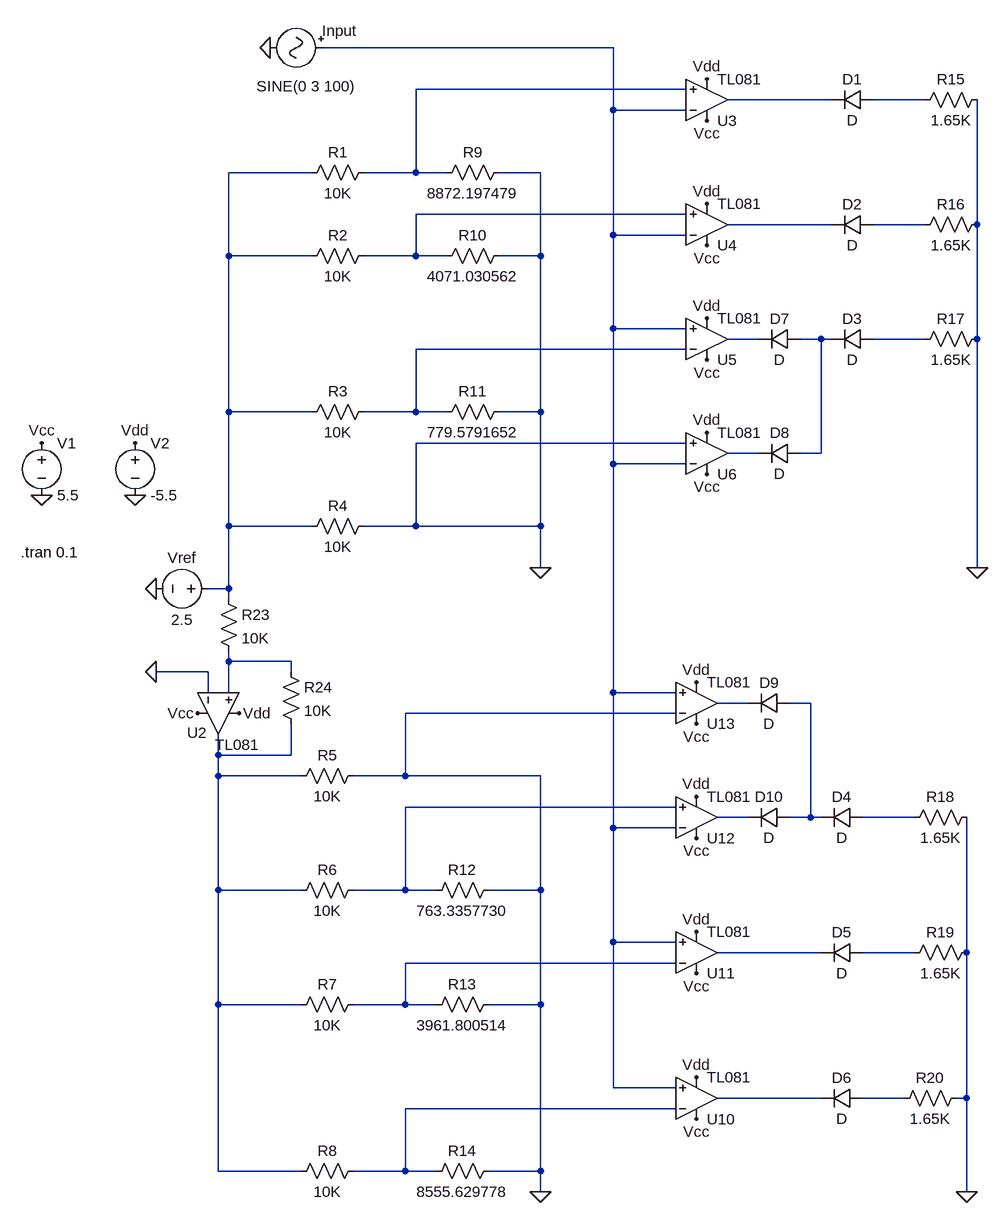
[diagram p0: schematic Komparator system.asc]
Komparator system.asc, the LTspice schematic file:
Version 4
SHEET 1 936 2496
WIRE 288 -560 -160 -560
WIRE 400 -496 -16 -496
WIRE 624 -480 464 -480
WIRE 768 -480 688 -480
WIRE 288 -464 288 -560
WIRE 400 -464 288 -464
WIRE -176 -368 -304 -368
WIRE -16 -368 -16 -496
WIRE -16 -368 -96 -368
WIRE 32 -368 -16 -368
WIRE 176 -368 112 -368
WIRE 400 -304 -16 -304
WIRE 624 -288 464 -288
WIRE 768 -288 688 -288
WIRE 848 -288 848 -480
WIRE 288 -272 288 -464
WIRE 400 -272 288 -272
WIRE -304 -240 -304 -368
WIRE -176 -240 -304 -240
WIRE -16 -240 -16 -304
WIRE -16 -240 -96 -240
WIRE 32 -240 -16 -240
WIRE 176 -240 176 -368
WIRE 176 -240 112 -240
WIRE 288 -128 288 -272
WIRE 400 -128 288 -128
WIRE 512 -112 464 -112
WIRE 608 -112 576 -112
WIRE 624 -112 608 -112
WIRE 768 -112 688 -112
WIRE 848 -112 848 -288
WIRE 400 -96 -16 -96
WIRE -304 0 -304 -240
WIRE -176 0 -304 0
WIRE -16 0 -16 -96
WIRE -16 0 -96 0
WIRE 32 0 -16 0
WIRE 176 0 176 -240
WIRE 176 0 112 0
WIRE 400 48 -16 48
WIRE 512 64 464 64
WIRE 608 64 608 -112
WIRE 608 64 576 64
WIRE 288 80 288 -128
WIRE 400 80 288 80
WIRE -304 176 -304 0
WIRE -176 176 -304 176
WIRE -16 176 -16 48
WIRE -16 176 -96 176
WIRE 176 176 176 0
WIRE 176 176 -16 176
WIRE 176 240 176 176
WIRE 848 240 848 -112
WIRE -304 272 -304 176
WIRE -304 272 -336 272
WIRE -304 288 -304 272
WIRE -304 384 -304 368
WIRE -208 384 -304 384
WIRE -336 400 -416 400
WIRE -208 400 -208 384
WIRE -336 432 -336 400
WIRE -304 432 -304 384
WIRE 288 432 288 80
WIRE 384 432 288 432
WIRE 496 448 448 448
WIRE 592 448 560 448
WIRE 384 464 -32 464
WIRE -320 528 -320 496
WIRE -208 528 -208 480
WIRE -208 528 -320 528
WIRE -320 560 -320 528
WIRE -192 560 -320 560
WIRE -32 560 -32 464
WIRE -32 560 -112 560
WIRE 176 560 -32 560
WIRE 384 608 -32 608
WIRE 496 624 448 624
WIRE 592 624 592 448
WIRE 592 624 560 624
WIRE 608 624 592 624
WIRE 752 624 672 624
WIRE 288 640 288 432
WIRE 384 640 288 640
WIRE -320 736 -320 560
WIRE -192 736 -320 736
WIRE -32 736 -32 608
WIRE -32 736 -112 736
WIRE 16 736 -32 736
WIRE 176 736 176 560
WIRE 176 736 96 736
WIRE 288 816 288 640
WIRE 384 816 288 816
WIRE 608 832 448 832
WIRE 752 832 672 832
WIRE 832 832 832 624
WIRE 384 848 -32 848
WIRE -320 912 -320 736
WIRE -192 912 -320 912
WIRE -32 912 -32 848
WIRE -32 912 -112 912
WIRE 16 912 -32 912
WIRE 176 912 176 736
WIRE 176 912 96 912
WIRE 288 1040 288 816
WIRE 384 1040 288 1040
WIRE 608 1056 448 1056
WIRE 736 1056 672 1056
WIRE 832 1056 832 832
WIRE 832 1056 816 1056
WIRE 384 1072 -32 1072
WIRE -320 1168 -320 912
WIRE -192 1168 -320 1168
WIRE -32 1168 -32 1072
WIRE -32 1168 -112 1168
WIRE 16 1168 -32 1168
WIRE 176 1168 176 912
WIRE 176 1168 96 1168
WIRE 176 1200 176 1168
WIRE 832 1200 832 1056
FLAG -416 272 0
FLAG -240 -560 0
FLAG -448 128 0
FLAG -592 128 0
FLAG 432 -448 Vcc
FLAG 432 -256 Vcc
FLAG 432 -80 Vcc
FLAG 432 96 Vcc
FLAG 432 32 Vdd
FLAG 432 -144 Vdd
FLAG 432 -320 Vdd
FLAG 432 -512 Vdd
FLAG -592 48 Vcc
FLAG -448 48 Vdd
FLAG 416 1088 Vcc
FLAG 416 1024 Vdd
FLAG 416 864 Vcc
FLAG 416 800 Vdd
FLAG 416 656 Vcc
FLAG 416 592 Vdd
FLAG 416 480 Vcc
FLAG 416 416 Vdd
FLAG 176 240 0
FLAG 848 240 0
FLAG -416 400 0
FLAG -352 464 Vcc
FLAG -288 464 Vdd
FLAG 176 1200 0
FLAG 832 1200 0
SYMBOL res 128 -16 R90
WINDOW 0 0 56 VBottom 2
WINDOW 3 32 56 VTop 2
SYMATTR InstName R11
SYMATTR Value 779.5791652
SYMBOL res -80 -16 R90
WINDOW 0 0 56 VBottom 2
WINDOW 3 32 56 VTop 2
SYMATTR InstName R3
SYMATTR Value 10K
SYMBOL res -80 -384 R90
WINDOW 0 0 56 VBottom 2
WINDOW 3 32 56 VTop 2
SYMATTR InstName R1
SYMATTR Value 10K
SYMBOL res 128 -384 R90
WINDOW 0 0 56 VBottom 2
WINDOW 3 32 56 VTop 2
SYMATTR InstName R9
SYMATTR Value 8872.197479
SYMBOL voltage -320 272 R90
WINDOW 0 -32 56 VBottom 2
WINDOW 3 32 56 VTop 2
WINDOW 123 0 0 Left 2
WINDOW 39 0 0 Left 2
SYMATTR InstName Vref
SYMATTR Value 2.5
SYMBOL Misc\\signal -144 -560 R90
WINDOW 123 24 44 Left 2
WINDOW 39 0 0 Left 2
WINDOW 0 -26 -38 VRight 2
WINDOW 3 59 -36 VRight 2
SYMATTR InstName Input
SYMATTR Value SINE(0 3 100)
SYMBOL res -80 -256 R90
WINDOW 0 0 56 VBottom 2
WINDOW 3 32 56 VTop 2
SYMATTR InstName R2
SYMATTR Value 10K
SYMBOL res 128 -256 R90
WINDOW 0 0 56 VBottom 2
WINDOW 3 32 56 VTop 2
SYMATTR InstName R10
SYMATTR Value 4071.030562
SYMBOL Opamps\\TL081 432 -416 M180
SYMATTR InstName U3
SYMBOL Opamps\\TL081 432 -224 M180
SYMATTR InstName U4
SYMBOL Opamps\\TL081 432 -48 M180
SYMATTR InstName U5
SYMBOL Opamps\\TL081 432 128 M180
SYMATTR InstName U6
SYMBOL voltage -592 32 R0
WINDOW 123 0 0 Left 2
WINDOW 39 0 0 Left 2
SYMATTR InstName V1
SYMATTR Value 5.5
SYMBOL voltage -448 32 R0
WINDOW 123 0 0 Left 2
WINDOW 39 0 0 Left 2
SYMATTR InstName V2
SYMATTR Value -5.5
SYMBOL diode 688 -496 R90
WINDOW 0 0 32 VBottom 2
WINDOW 3 32 32 VTop 2
SYMATTR InstName D1
SYMBOL diode 688 -304 R90
WINDOW 0 0 32 VBottom 2
WINDOW 3 32 32 VTop 2
SYMATTR InstName D2
SYMBOL res 864 -496 R90
WINDOW 0 0 56 VBottom 2
WINDOW 3 32 56 VTop 2
SYMATTR InstName R15
SYMATTR Value 1.65K
SYMBOL res 864 -304 R90
WINDOW 0 0 56 VBottom 2
WINDOW 3 32 56 VTop 2
SYMATTR InstName R16
SYMATTR Value 1.65K
SYMBOL res 864 -128 R90
WINDOW 0 0 56 VBottom 2
WINDOW 3 32 56 VTop 2
SYMATTR InstName R17
SYMATTR Value 1.65K
SYMBOL res -80 160 R90
WINDOW 0 0 56 VBottom 2
WINDOW 3 32 56 VTop 2
SYMATTR InstName R4
SYMATTR Value 10K
SYMBOL res -96 1152 R90
WINDOW 0 0 56 VBottom 2
WINDOW 3 32 56 VTop 2
SYMATTR InstName R8
SYMATTR Value 10K
SYMBOL res 112 1152 R90
WINDOW 0 0 56 VBottom 2
WINDOW 3 32 56 VTop 2
SYMATTR InstName R14
SYMATTR Value 8555.629778
SYMBOL Opamps\\TL081 416 1120 M180
SYMATTR InstName U10
SYMBOL res 832 1040 R90
WINDOW 0 0 56 VBottom 2
WINDOW 3 32 56 VTop 2
SYMATTR InstName R20
SYMATTR Value 1.65K
SYMBOL res -96 896 R90
WINDOW 0 0 56 VBottom 2
WINDOW 3 32 56 VTop 2
SYMATTR InstName R7
SYMATTR Value 10K
SYMBOL res 112 896 R90
WINDOW 0 0 56 VBottom 2
WINDOW 3 32 56 VTop 2
SYMATTR InstName R13
SYMATTR Value 3961.800514
SYMBOL Opamps\\TL081 416 896 M180
SYMATTR InstName U11
SYMBOL res 112 720 R90
WINDOW 0 0 56 VBottom 2
WINDOW 3 32 56 VTop 2
SYMATTR InstName R12
SYMATTR Value 763.3357730
SYMBOL res -96 720 R90
WINDOW 0 0 56 VBottom 2
WINDOW 3 32 56 VTop 2
SYMATTR InstName R6
SYMATTR Value 10K
SYMBOL Opamps\\TL081 416 688 M180
SYMATTR InstName U12
SYMBOL res 848 608 R90
WINDOW 0 0 56 VBottom 2
WINDOW 3 32 56 VTop 2
SYMATTR InstName R18
SYMATTR Value 1.65K
SYMBOL diode 672 1040 R90
WINDOW 0 0 32 VBottom 2
WINDOW 3 32 32 VTop 2
SYMATTR InstName D6
SYMBOL diode 672 816 R90
WINDOW 0 0 32 VBottom 2
WINDOW 3 32 32 VTop 2
SYMATTR InstName D5
SYMBOL res 848 816 R90
WINDOW 0 0 56 VBottom 2
WINDOW 3 32 56 VTop 2
SYMATTR InstName R19
SYMATTR Value 1.65K
SYMBOL Opamps\\TL081 416 512 M180
SYMATTR InstName U13
SYMBOL res -96 544 R90
WINDOW 0 0 56 VBottom 2
WINDOW 3 32 56 VTop 2
SYMATTR InstName R5
SYMATTR Value 10K
SYMBOL Opamps\\TL081 -384 464 M90
WINDOW 0 30 47 VLeft 2
WINDOW 3 48 128 VLeft 2
SYMATTR InstName U2
SYMBOL res -320 272 R0
SYMATTR InstName R23
SYMATTR Value 10K
SYMBOL res -224 384 R0
SYMATTR InstName R24
SYMATTR Value 10K
SYMBOL diode 576 -128 R90
WINDOW 0 0 32 VBottom 2
WINDOW 3 32 32 VTop 2
SYMATTR InstName D7
SYMBOL diode 576 48 R90
WINDOW 0 0 32 VBottom 2
WINDOW 3 32 32 VTop 2
SYMATTR InstName D8
SYMBOL diode 560 432 R90
WINDOW 0 0 32 VBottom 2
WINDOW 3 32 32 VTop 2
SYMATTR InstName D9
SYMBOL diode 560 608 R90
WINDOW 0 0 32 VBottom 2
WINDOW 3 32 32 VTop 2
SYMATTR InstName D10
SYMBOL diode 688 -128 R90
WINDOW 0 0 32 VBottom 2
WINDOW 3 32 32 VTop 2
SYMATTR InstName D3
SYMBOL diode 672 608 R90
WINDOW 0 0 32 VBottom 2
WINDOW 3 32 32 VTop 2
SYMATTR InstName D4
TEXT -624 216 Left 2 !.tran 0.1

The netlist it stands for:
* Komparator system.asc
R11 0 N012 779.5791652
R3 N012 N005 10K
R1 N002 N005 10K
R9 0 N002 8872.197479
Vref N005 0 2.5
V§Input N001 0 SINE(0 3 100)
R2 N006 N005 10K
R10 0 N006 4071.030562
XU3 N002 N001 Vcc Vdd N003 TL081  ; pins In+ In- V+ V- OUT
XU4 N006 N001 Vcc Vdd N007 TL081  ; pins In+ In- V+ V- OUT
XU5 N001 N012 Vcc Vdd N009 TL081  ; pins In+ In- V+ V- OUT
XU6 0 N001 Vcc Vdd N013 TL081  ; pins In+ In- V+ V- OUT
V1 Vcc 0 5.5
V2 Vdd 0 -5.5
D1 N004 N003 D
D2 N008 N007 D
R15 0 N004 1.65K
R16 0 N008 1.65K
R17 0 N011 1.65K
R4 0 N005 10K
R8 N026 N017 10K
R14 0 N026 8555.629778
XU10 N001 N026 Vcc Vdd N024 TL081  ; pins In+ In- V+ V- OUT
R20 0 N025 1.65K
R7 N023 N017 10K
R13 0 N023 3961.800514
XU11 N001 N023 Vcc Vdd N021 TL081  ; pins In+ In- V+ V- OUT
R12 0 N018 763.3357730
R6 N018 N017 10K
XU12 N018 N001 Vcc Vdd N019 TL081  ; pins In+ In- V+ V- OUT
R18 0 N020 1.65K
D6 N025 N024 D
D5 N022 N021 D
R19 0 N022 1.65K
XU13 N001 0 Vcc Vdd N015 TL081  ; pins In+ In- V+ V- OUT
R5 0 N017 10K
XU2 N014 0 Vcc Vdd N017 TL081  ; pins In+ In- V+ V- OUT
R23 N005 N014 10K
R24 N014 N017 10K
D7 N010 N009 D
D8 N010 N013 D
D9 N016 N015 D
D10 N016 N019 D
D3 N011 N010 D
D4 N020 N016 D
.model D D
.lib standard.dio
.tran 0.1
.backanno
.end